# EAGLE design MK2560EM-G v1G.1 (EAGLE 9.5.1)
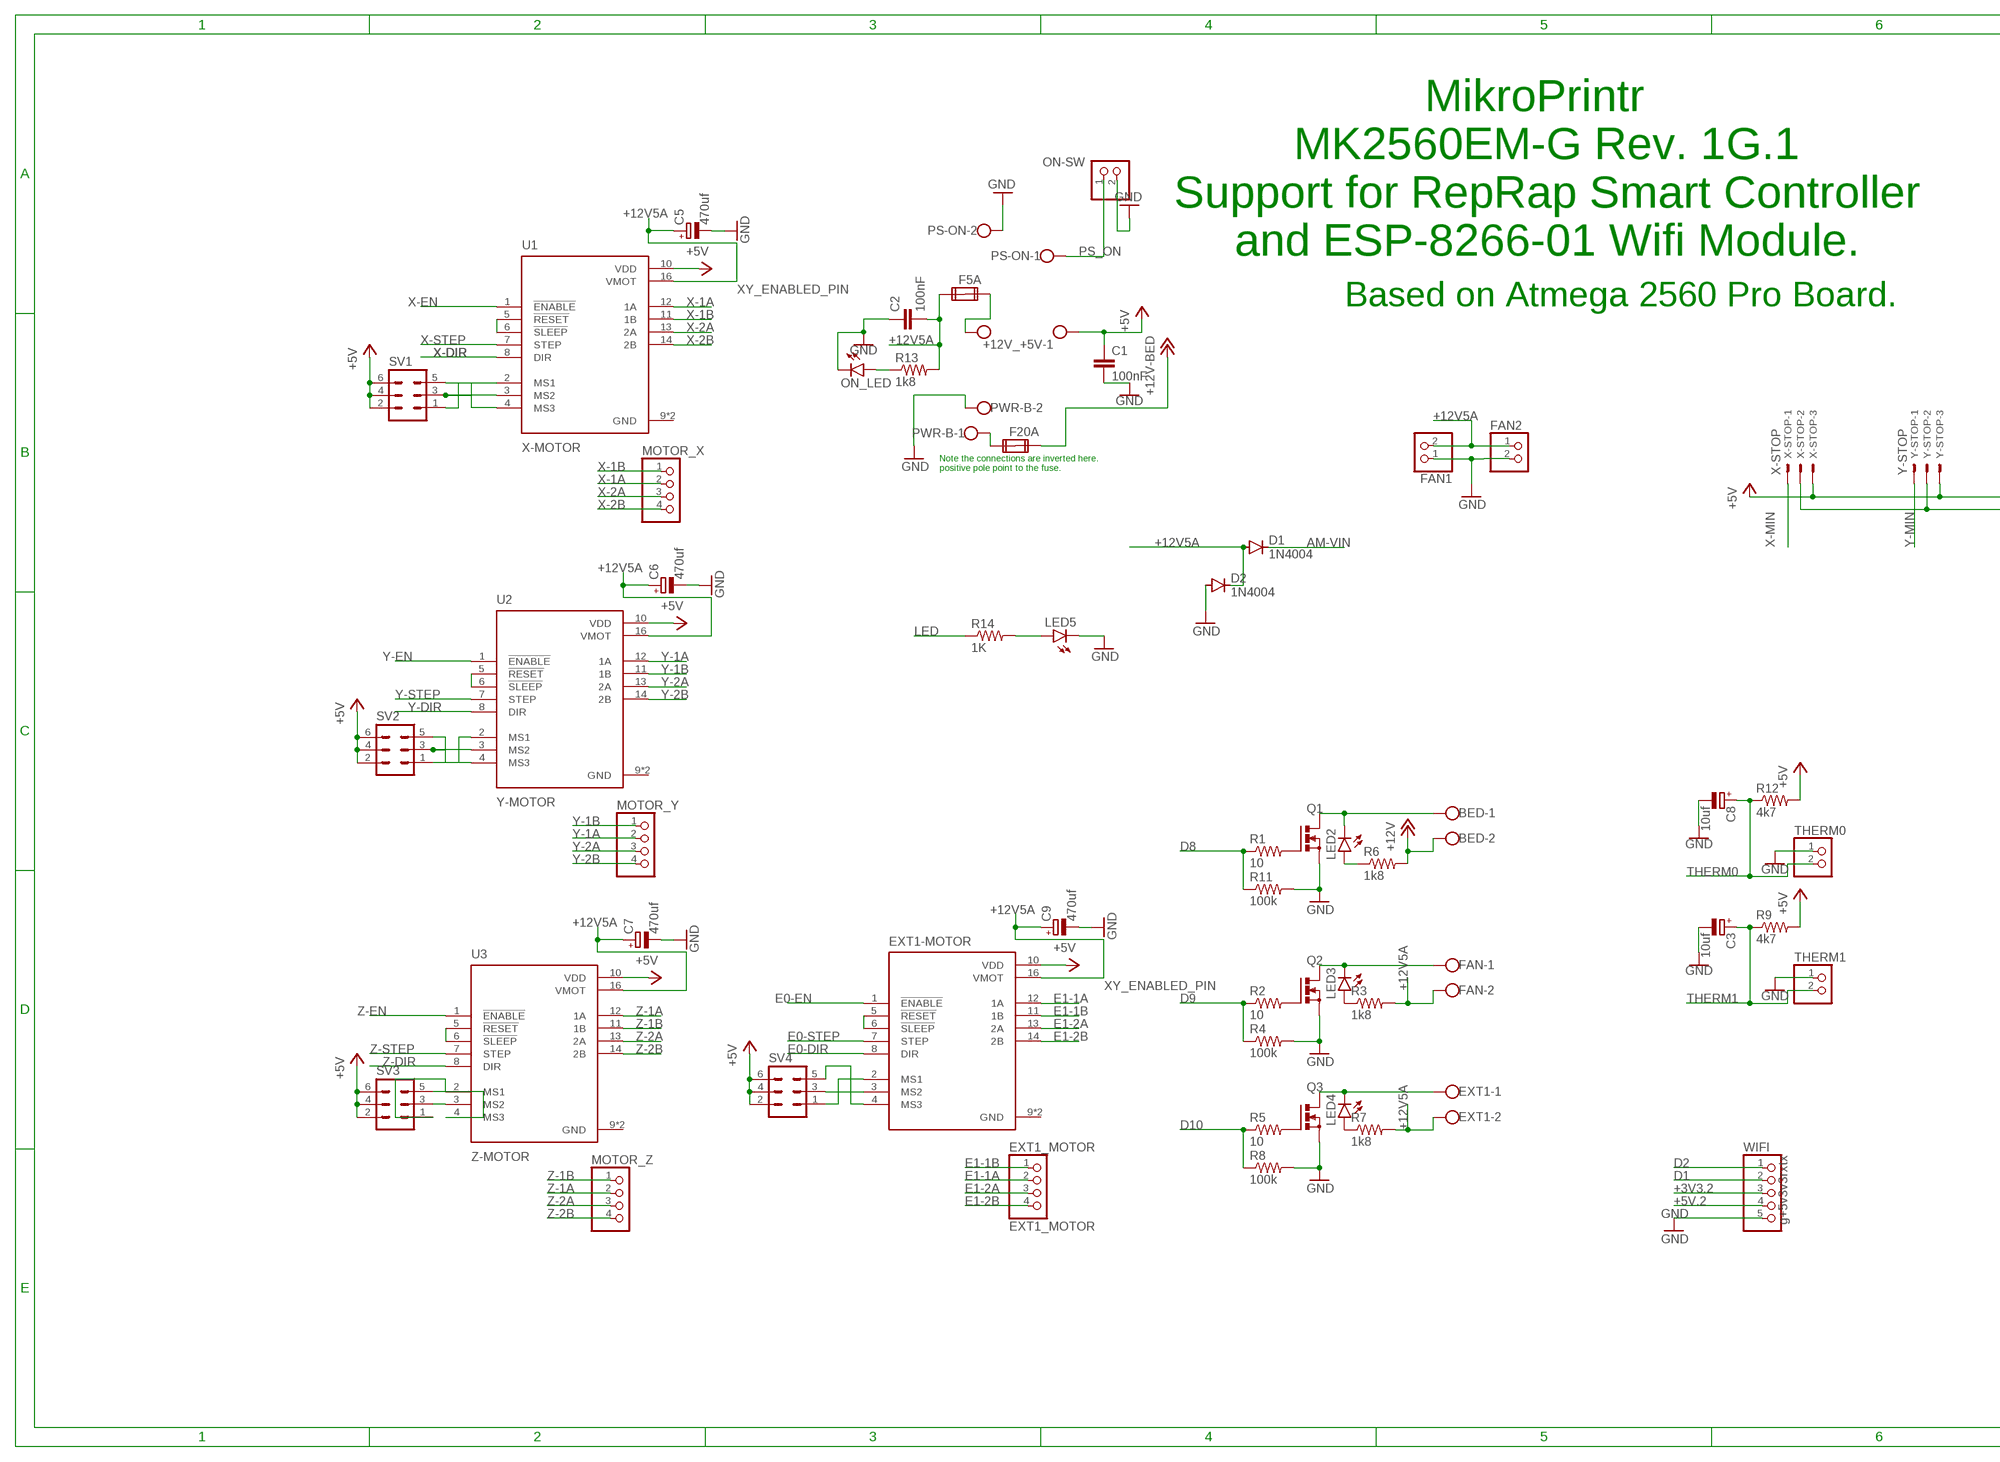
[diagram p0: schematic, sheet 1, part 1 of 2]
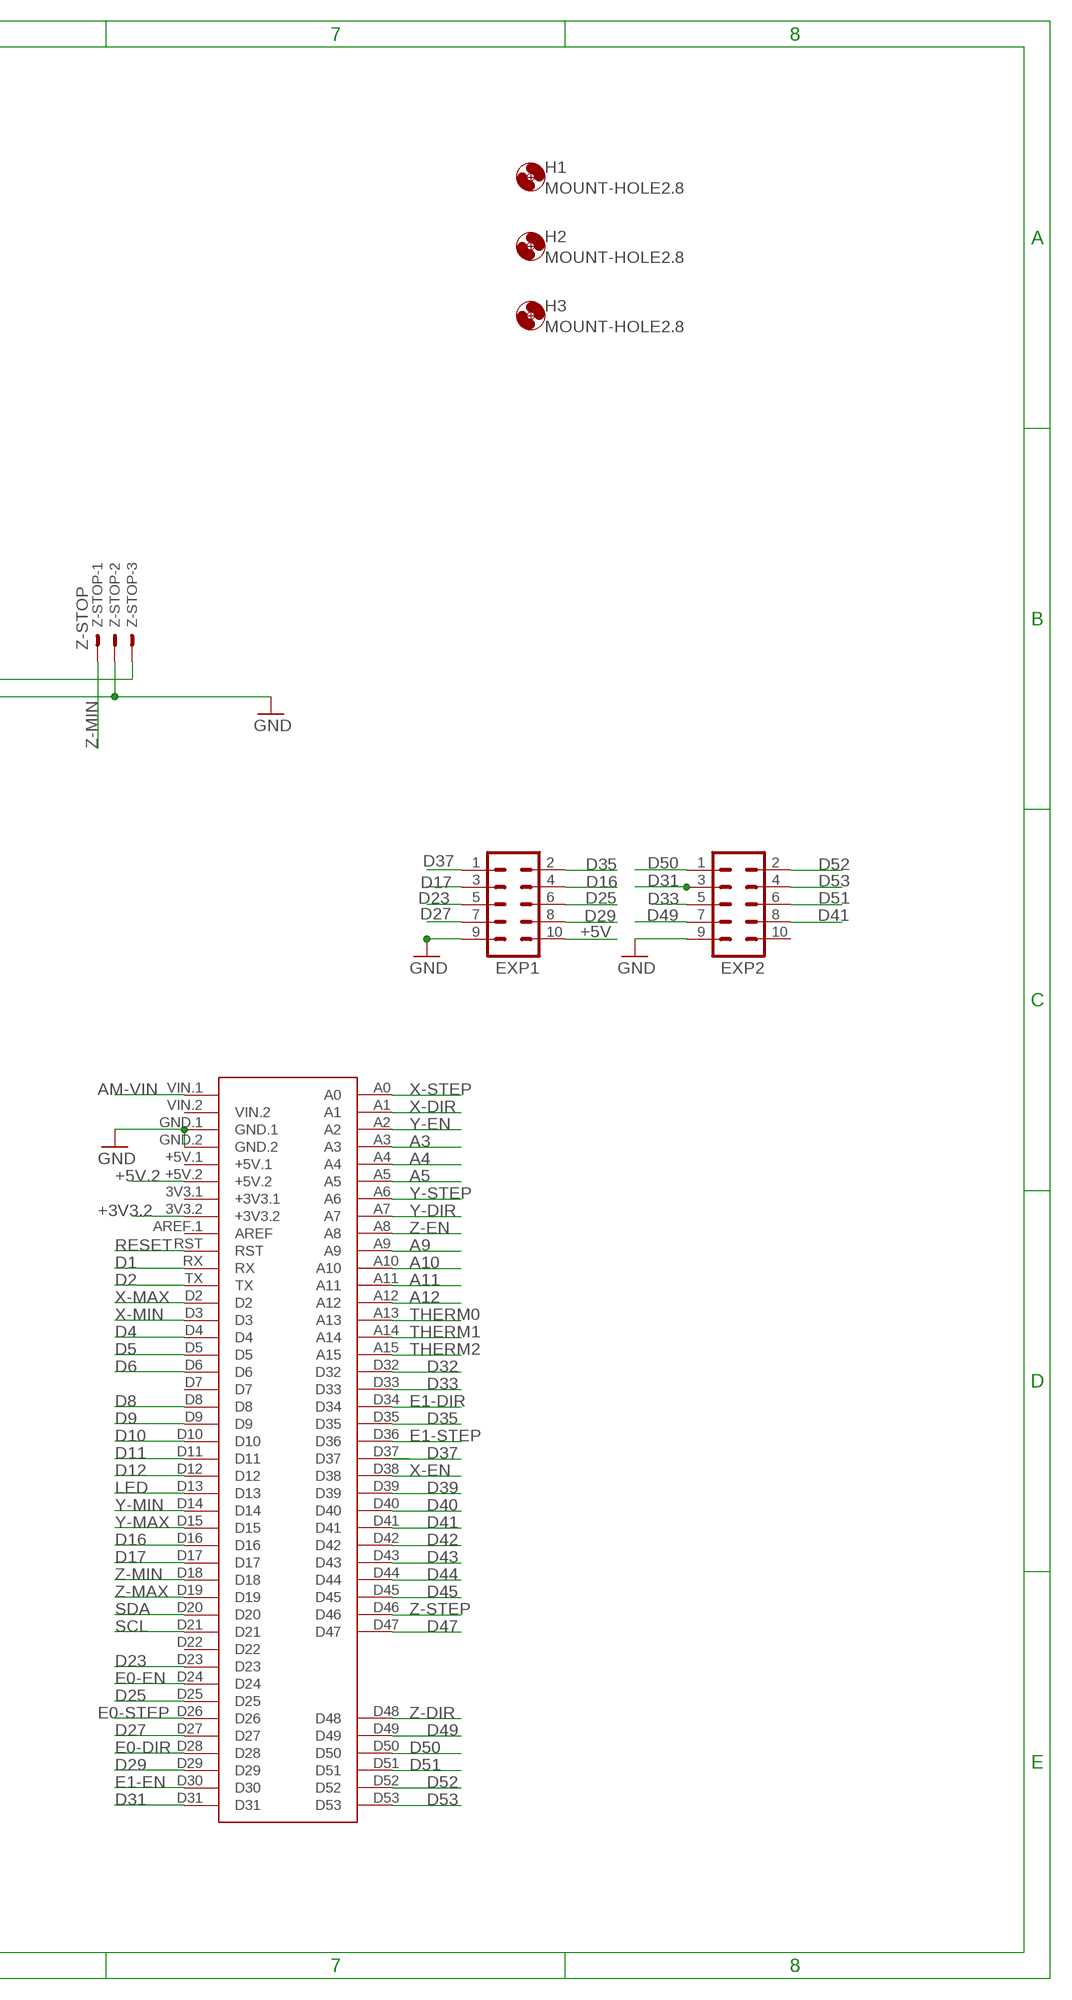
[diagram p1: schematic, sheet 1, part 2 of 2]

## Parts
+12V_+5V  W237-102  [W237-102]
ARD-MEGA  MEGA2560_MIKRO  [MEGA2560_MIKRO]
BED  W237-102  [W237-102]
C1  100nF  C-EU025-025X050  [C025-025X050]
C2  100nF  C-EU025-025X050  [C025-025X050]
C3  10uf  CPOL-EUE2.5-6  [E2,5-6]
C5  470uf  CPOL-EUE2,5-6E  [E2,5-6E]
C6  470uf  CPOL-EUE2,5-6E  [E2,5-6E]
C7  470uf  CPOL-EUE2,5-6E  [E2,5-6E]
C8  10uf  CPOL-EUE2.5-6  [E2,5-6]
C9  470uf  CPOL-EUE2,5-6E  [E2,5-6E]
D1  1N4004  [DO41-10]
D2  1N4004  [DO41-10]
EXP1  MA05-2  [MA05-2]
EXP2  MA05-2  [MA05-2]
EXT1  W237-102  [W237-102]
EXT1-MOTOR  A4988_STEPPER_MOTOR_DRIVER_CARRIER  [MODULE_A4988_STEPPER_MOTOR_DRIVER_CARRIER]
EXT1_MOTOR  EXT1_MOTOR  PINHD-1X4  [1X04]
F5A  FUSE2P  [FUSE1]
F20A  FUSE2P  [FUSE1]
FAN  W237-102  [W237-102]
FAN1  PINHD-1X2  [1X02]
FAN2  PINHD-1X2  [1X02]
H1  MOUNT-HOLE2.8  [2,8]
H2  MOUNT-HOLE2.8  [2,8]
H3  MOUNT-HOLE2.8  [2,8]
LED2  LED3MM  [LED3MM]
LED3  LED3MM  [LED3MM]
LED4  LED3MM  [LED3MM]
LED5  LED3MM  [LED3MM]
MOTOR_X  PINHD-1X4  [1X04]
MOTOR_Y  PINHD-1X4  [1X04]
MOTOR_Z  PINHD-1X4  [1X04]
ON-SW  PINHD-1X2  [1X02]
ON_LED  LED3MM  [LED3MM]
PS-ON  W237-102  [W237-102]
PWR-B  W237-102  [W237-102]
Q1  PMOSFET_NTO220BV  [TO220BV]
Q2  PMOSFET_NTO220BV  [TO220BV]
Q3  PMOSFET_NTO220BV  [TO220BV]
R1  10  R-US_0204/7  [0204/7]
R2  10  R-US_0204/7  [0204/7]
R3  1k8  R-US_0204/7  [0204/7]
R4  100k  R-US_0204/7  [0204/7]
R5  10  R-US_0204/7  [0204/7]
R6  1k8  R-US_0204/7  [0204/7]
R7  1k8  R-US_0204/7  [0204/7]
R8  100k  R-US_0204/7  [0204/7]
R9  4k7  R-US_0204/7  [0204/7]
R11  100k  R-US_0204/7  [0204/7]
R12  4k7  R-US_0204/7  [0204/7]
R13  1k8  R-US_0204/7  [0204/7]
R14  1K  R-US_0204/7  [0204/7]
SV1  MA03-2  [MA03-2]
SV2  MA03-2  [MA03-2]
SV3  MA03-2  [MA03-2]
SV4  MA03-2  [MA03-2]
THERM0  PINHD-1X2  [1X02]
THERM1  PINHD-1X2  [1X02]
U1  X-MOTOR  A4988_STEPPER_MOTOR_DRIVER_CARRIER  [MODULE_A4988_STEPPER_MOTOR_DRIVER_CARRIER]
U2  Y-MOTOR  A4988_STEPPER_MOTOR_DRIVER_CARRIER  [MODULE_A4988_STEPPER_MOTOR_DRIVER_CARRIER]
U3  Z-MOTOR  A4988_STEPPER_MOTOR_DRIVER_CARRIER  [MODULE_A4988_STEPPER_MOTOR_DRIVER_CARRIER]
WIFI  g+5v3v3rxtx  PINHD-1X5  [1X05]
X-STOP  X-STOP  22-23-2031  [22-23-2031]
Y-STOP  Y-STOP  22-23-2031  [22-23-2031]
Z-STOP  Z-STOP  22-23-2031  [22-23-2031]

## Nets
+3V3.2: ARD-MEGA.3V3.2(+3V3.2) WIFI.3
+5V: +12V_+5V.1 C1.1 EXP1.10 EXT1-MOTOR.10(VDD) R9.2 R12.2 SV1.2 SV1.4 SV1.6 SV2.2 SV2.4 SV2.6 SV3.2 SV3.4 SV3.6 SV4.2 SV4.4 SV4.6 U1.10(VDD) U2.10(VDD) U3.10(VDD) X-STOP.3 Y-STOP.3 Z-STOP.3
+5V.2: ARD-MEGA.+5V.2 WIFI.4
+12V: BED.2 F20A.2A R6.2 ; supply symbol labelled +12V-BED
+12V5A: C2.2 C5.+ C6.+ C7.+ C9.+ D1.A D2.C EXT1-MOTOR.16(VMOT) EXT1.2 F5A.1A FAN1.2 FAN2.1 FAN.2 R3.2 R7.2 R13.2 U1.16(VMOT) U2.16(VMOT) U3.16(VMOT)
A3: ARD-MEGA.A3
A4: ARD-MEGA.A4
A5: ARD-MEGA.A5
A9: ARD-MEGA.A9
A10: ARD-MEGA.A10
A11: ARD-MEGA.A11
A12: ARD-MEGA.A12
AM-VIN: ARD-MEGA.VIN.1 D1.C
D1: ARD-MEGA.RX WIFI.2
D2: ARD-MEGA.TX WIFI.1
D4: ARD-MEGA.D4
D5: ARD-MEGA.D5
D6: ARD-MEGA.D6
D8: ARD-MEGA.D8 R1.1 R11.1
D9: ARD-MEGA.D9 R2.1 R4.1
D10: ARD-MEGA.D10 R5.1 R8.1
D11: ARD-MEGA.D11
D12: ARD-MEGA.D12
D16: ARD-MEGA.D16 EXP1.4
D17: ARD-MEGA.D17 EXP1.3
D23: ARD-MEGA.D23 EXP1.5
D25: ARD-MEGA.D25 EXP1.6
D27: ARD-MEGA.D27 EXP1.7
D29: ARD-MEGA.D29 EXP1.8
D31: ARD-MEGA.D31 EXP2.3
D32: ARD-MEGA.D32
D33: ARD-MEGA.D33 EXP2.5
D35: ARD-MEGA.D35 EXP1.2
D37: ARD-MEGA.D37 EXP1.1
D39: ARD-MEGA.D39
D40: ARD-MEGA.D40
D41: ARD-MEGA.D41 EXP2.8
D42: ARD-MEGA.D42
D43: ARD-MEGA.D43
D44: ARD-MEGA.D44
D45: ARD-MEGA.D45
D47: ARD-MEGA.D47
D49: ARD-MEGA.D49 EXP2.7
D50: ARD-MEGA.D50 EXP2.1
D51: ARD-MEGA.D51 EXP2.6
D52: ARD-MEGA.D52 EXP2.2
D53: ARD-MEGA.D53 EXP2.4
E0-DIR: ARD-MEGA.D28 EXT1-MOTOR.8(DIR)
E0-EN: ARD-MEGA.D24 EXT1-MOTOR.1(!ENABLE)
E0-STEP: ARD-MEGA.D26 EXT1-MOTOR.7(STEP)
E1-1A: EXT1-MOTOR.12(1A) EXT1_MOTOR.2
E1-1B: EXT1-MOTOR.11(1B) EXT1_MOTOR.1
E1-2A: EXT1-MOTOR.13(2A) EXT1_MOTOR.3
E1-2B: EXT1-MOTOR.14(2B) EXT1_MOTOR.4
E1-DIR: ARD-MEGA.D34
E1-EN: ARD-MEGA.D30
E1-STEP: ARD-MEGA.D36
GND: ARD-MEGA.GND.1 ARD-MEGA.GND.2 C1.2 C2.1 C3.- C5.- C6.- C7.- C8.- C9.- D2.A EXP1.9 EXP2.9 FAN1.1 FAN2.2 LED5.K(C) ON-SW.2 ON_LED.K(C) PS-ON.2 PWR-B.2 Q1.S Q2.S Q3.S R4.2 R8.2 R11.2 THERM0.1 THERM1.1 WIFI.5 X-STOP.2 Y-STOP.2 Z-STOP.2
LED: ARD-MEGA.D13 R14.1
N$1: Q2.G R2.2
N$2: FAN.1 LED3.K(C) Q2.D
N$3: LED3.A R3.1
N$4: Q3.G R5.2
N$5: EXT1.1 LED4.K(C) Q3.D
N$6: LED4.A R7.1
N$7: BED.1 LED2.K(C) Q1.D
N$8: LED2.A R6.1
N$9: SV1.1 U1.2(MS1)
N$10: SV1.3 U1.3(MS2)
N$11: SV1.5 U1.4(MS3)
N$12: U2.5(!RESET) U2.6(!SLEEP)
N$13: U1.5(!RESET) U1.6(!SLEEP)
N$14: SV2.1 U2.2(MS1)
N$15: SV2.3 U2.3(MS2)
N$16: SV2.5 U2.4(MS3)
N$17: U3.5(!RESET) U3.6(!SLEEP)
N$18: ON_LED.A R13.1
N$19: SV3.3 U3.3(MS2)
N$20: Q1.G R1.2
N$21: SV3.1 U3.2(MS1)
N$22: SV3.5 U3.4(MS3)
N$23: EXT1-MOTOR.5(!RESET) EXT1-MOTOR.6(!SLEEP)
N$24: EXT1-MOTOR.3(MS2) SV4.3
N$25: EXT1-MOTOR.4(MS3) SV4.5
N$26: EXT1-MOTOR.2(MS1) SV4.1
N$27: +12V_+5V.2 F5A.2A
N$28: LED5.A R14.2
N$29: F20A.1A PWR-B.1
PS_ON: ON-SW.1 PS-ON.1
RESET: ARD-MEGA.RST
SCL: ARD-MEGA.D21
SDA: ARD-MEGA.D20
THERM0: ARD-MEGA.A13 C8.+ R12.1 THERM0.2
THERM1: ARD-MEGA.A14 C3.+ R9.1 THERM1.2
THERM2: ARD-MEGA.A15
X-1A: MOTOR_X.2 U1.12(1A)
X-1B: MOTOR_X.1 U1.11(1B)
X-2A: MOTOR_X.3 U1.13(2A)
X-2B: MOTOR_X.4 U1.14(2B)
X-DIR: ARD-MEGA.A1 U1.8(DIR)
X-EN: ARD-MEGA.D38 U1.1(!ENABLE)
X-MAX: ARD-MEGA.D2
X-MIN: ARD-MEGA.D3 X-STOP.1
X-STEP: ARD-MEGA.A0 U1.7(STEP)
Y-1A: MOTOR_Y.2 U2.12(1A)
Y-1B: MOTOR_Y.1 U2.11(1B)
Y-2A: MOTOR_Y.3 U2.13(2A)
Y-2B: MOTOR_Y.4 U2.14(2B)
Y-DIR: ARD-MEGA.A7 U2.8(DIR)
Y-EN: ARD-MEGA.A2 U2.1(!ENABLE)
Y-MAX: ARD-MEGA.D15
Y-MIN: ARD-MEGA.D14 Y-STOP.1
Y-STEP: ARD-MEGA.A6 U2.7(STEP)
Z-1A: MOTOR_Z.2 U3.12(1A)
Z-1B: MOTOR_Z.1 U3.11(1B)
Z-2A: MOTOR_Z.3 U3.13(2A)
Z-2B: MOTOR_Z.4 U3.14(2B)
Z-DIR: ARD-MEGA.D48 U3.8(DIR)
Z-EN: ARD-MEGA.A8 U3.1(!ENABLE)
Z-MAX: ARD-MEGA.D19
Z-MIN: ARD-MEGA.D18 Z-STOP.1
Z-STEP: ARD-MEGA.D46 U3.7(STEP)
Unconnected: ARD-MEGA.3V3.1(+3V3.1) ARD-MEGA.+5V.1 ARD-MEGA.AREF.1(AREF) ARD-MEGA.D7 ARD-MEGA.D22 ARD-MEGA.VIN.2 EXP2.10 F5A.1B F5A.2B F20A.1B F20A.2B

## Notes on the sheet
- MikroPrintr  
  MK2560EM-G Rev. 1G.1
  Support for RepRap Smart Controller
  and ESP-8266-01 Wifi Module.
- Based on Atmega 2560 Pro Board.
- Note the connections are inverted here.
  positive pole point to the fuse.

## Power pins joined to a net without a drawn wire
GND: EXT1-MOTOR.9(GND) EXT1-MOTOR.15(GND) U1.9(GND) U1.15(GND) U2.9(GND) U2.15(GND) U3.9(GND) U3.15(GND)

## Library data of the parts
+12V_+5V BED EXT1 FAN PS-ON PWR-B = con-wago-500:W237-102: WAGO SCREW CLAMP; MPN: 237-102; OC_FARNELL: unknown; OC_NEWARK: 70K9898
ARD-MEGA = MIKRO_MEGA2560:MEGA2560_MIKRO: Arduino Mega2560 pro robotDyn, create by mikroavr.com
C1 C2 = rcl:C-EU: CAPACITOR, European symbol; SPICEPREFIX: C
C3 C5-C9 = rcl:CPOL-EU: POLARIZED CAPACITOR, European symbol; SPICEPREFIX: C
D1 D2 = diode:1N4004: DIODE general purpose rectifier, 1 A
EXP1 EXP2 = con-lstb:MA05-2: PIN HEADER; OC_FARNELL: unknown; OC_NEWARK: unknown
EXT1-MOTOR U1-U3 = A4988_STEPPER_MOTOR_DRIVER_CARRIER:A4988_STEPPER_MOTOR_DRIVER_CARRIER: Stepper motor controler; IC: A4988; 1A; Uin mot: 8÷35V Check availability <https://pricing.snapeda.com/parts/A4988%20STEPPER%20MOTOR%20DRIVER%20CARRIER/Pololu/view-part?ref=eda>; AVAILABILITY: Not in stock; DESCRIPTION: Stepper Motor Driver; MF: Pololu; MP: A4988 STEPPER MOTOR DRIVER CARRIER; PACKAGE: None; PRICE: None
EXT1_MOTOR MOTOR_X MOTOR_Y MOTOR_Z = -redpic-connector:PINHD-1X4: Pin Header 4
F5A F20A = special:FUSE2P: FUSE 5 x 20 mm
FAN1 FAN2 = pinhead:PINHD-1X2: PIN HEADER
H1-H3 = holes:MOUNT-HOLE: MOUNTING HOLE with drill center marker
LED2-LED5 ON_LED = led:LED: LED OSRAM: - CHIPLED LG R971, LG N971, LY N971, LG Q971, LY Q971, LO R971, LY R971 LH N974, LH R974 LS Q976, LO Q976, LY Q976 LO Q996 - Hyper CHIPLED LW Q18S LB Q993, LB Q99A, LB R99A - SideLED LS A670, LO A670, LY A670, LG A670, LP A670 LB A673, LV A673, LT A673, LW A673 LH A674 LY A675 LS A676, LA A676, LO A676, LY A676, LW A676 LS A679, LY A679, LG A679 - Hyper Micro SIDELED® LS Y876, LA Y876, LO Y876, LY Y876 LT Y87S - SmartLED LW L88C, LW L88S LB L89C, LB L89S, LG L890 LS L89K, LO L89K, LY L89K LS L896, LA L896, LO L896, LY L896 - TOPLED LS T670, LO T670, LY T670, LG T670, LP T670 LSG T670, LSP T670, LSY T670, LOP T670, LYG T670 LG T671, LOG T671, LSG T671 LB T673, LV T673, LT T673, LW T673 LH T674 LS T676, LA T676, LO T676, LY T676, LB T676, LH T676, LSB T676, LW T676 LB T67C, LV T67C, LT T67C, LS T67K, LO T67K, LY T67K, LW E67C LS E67B, LA E67B, LO E67B, LY E67B, LB E67C, LV E67C, LT E67C LW T67C LS T679, LY T679, LG T679 LS T770, LO T770, LY T770, LG T770, LP T770 LB T773, LV T773, LT T773, LW T773 LH T774 LS E675, LA E675, LY E675, LS T675 LS T776, LA T776, LO T776, LY T776, LB T776 LHGB T686 LT T68C, LB T68C - Hyper Mini TOPLED® LB M676 - Mini TOPLED Santana® LG M470 LS M47K, LO M47K, LY M47K Source: http://www.osram.convergy.de LUXEON: - LUMILED® LXK2-PW12-R00, LXK2-PW12-S00, LXK2-PW14-U00, LXK2-PW14-V00 LXK2-PM12-R00, LXK2-PM12-S00, LXK2-PM14-U00 LXK2-PE12-Q00, LXK2-PE12-R00, LXK2-PE12-S00, LXK2-PE14-T00, LXK2-PE14-U00 LXK2-PB12-K00, LXK2-PB12-L00, LXK2-PB12-M00, LXK2-PB14-N00, LXK2-PB14-P00, LXK2-PB14-Q00 LXK2-PR12-L00, LXK2-PR12-M00, LXK2-PR14-Q00, LXK2-PR14-R00 LXK2-PD12-Q00, LXK2-PD12-R00, LXK2-PD12-S00 LXK2-PH12-R00, LXK2-PH12-S00 LXK2-PL12-P00, LXK2-PL12-Q00, LXK2-PL12-R00 Source: www.luxeon.com KINGBRIGHT: KA-3528ASYC Source: www.kingbright.com
ON-SW THERM0 THERM1 = -redpic-connector:PINHD-1X2: Pin Header 2
Q1-Q3 = transistor-power:PMOSFET_N: Power MOSFET N-Channel
R1-R9 R11-R14 = resistor:R-US_: RESISTOR, American symbol
SV1-SV4 = con-lstb:MA03-2: PIN HEADER; OC_FARNELL: unknown; OC_NEWARK: unknown
WIFI = pinhead:PINHD-1X5: PIN HEADER
X-STOP Y-STOP Z-STOP = con-molex:22-23-2031: .100" (2.54mm) Center Header - 3 Pin; MF: MOLEX; MPN: 22-23-2031; OC_FARNELL: 1462950; OC_NEWARK: 30C0862

## Board
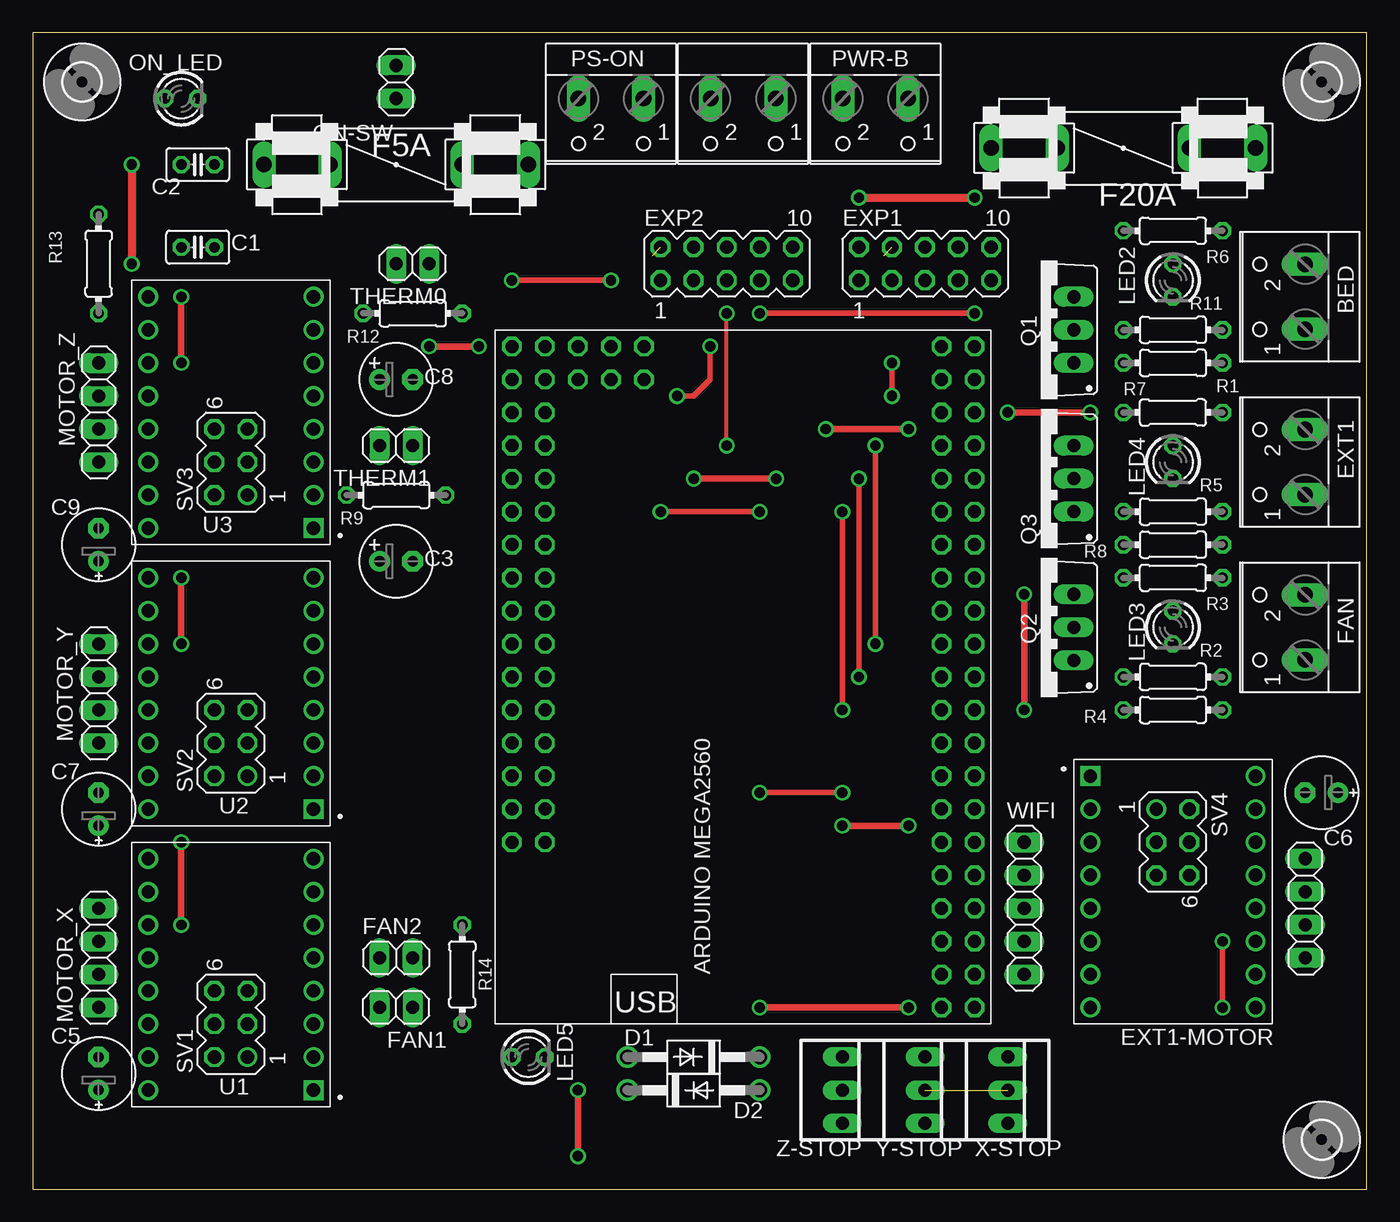
[diagram p2: board, top side]
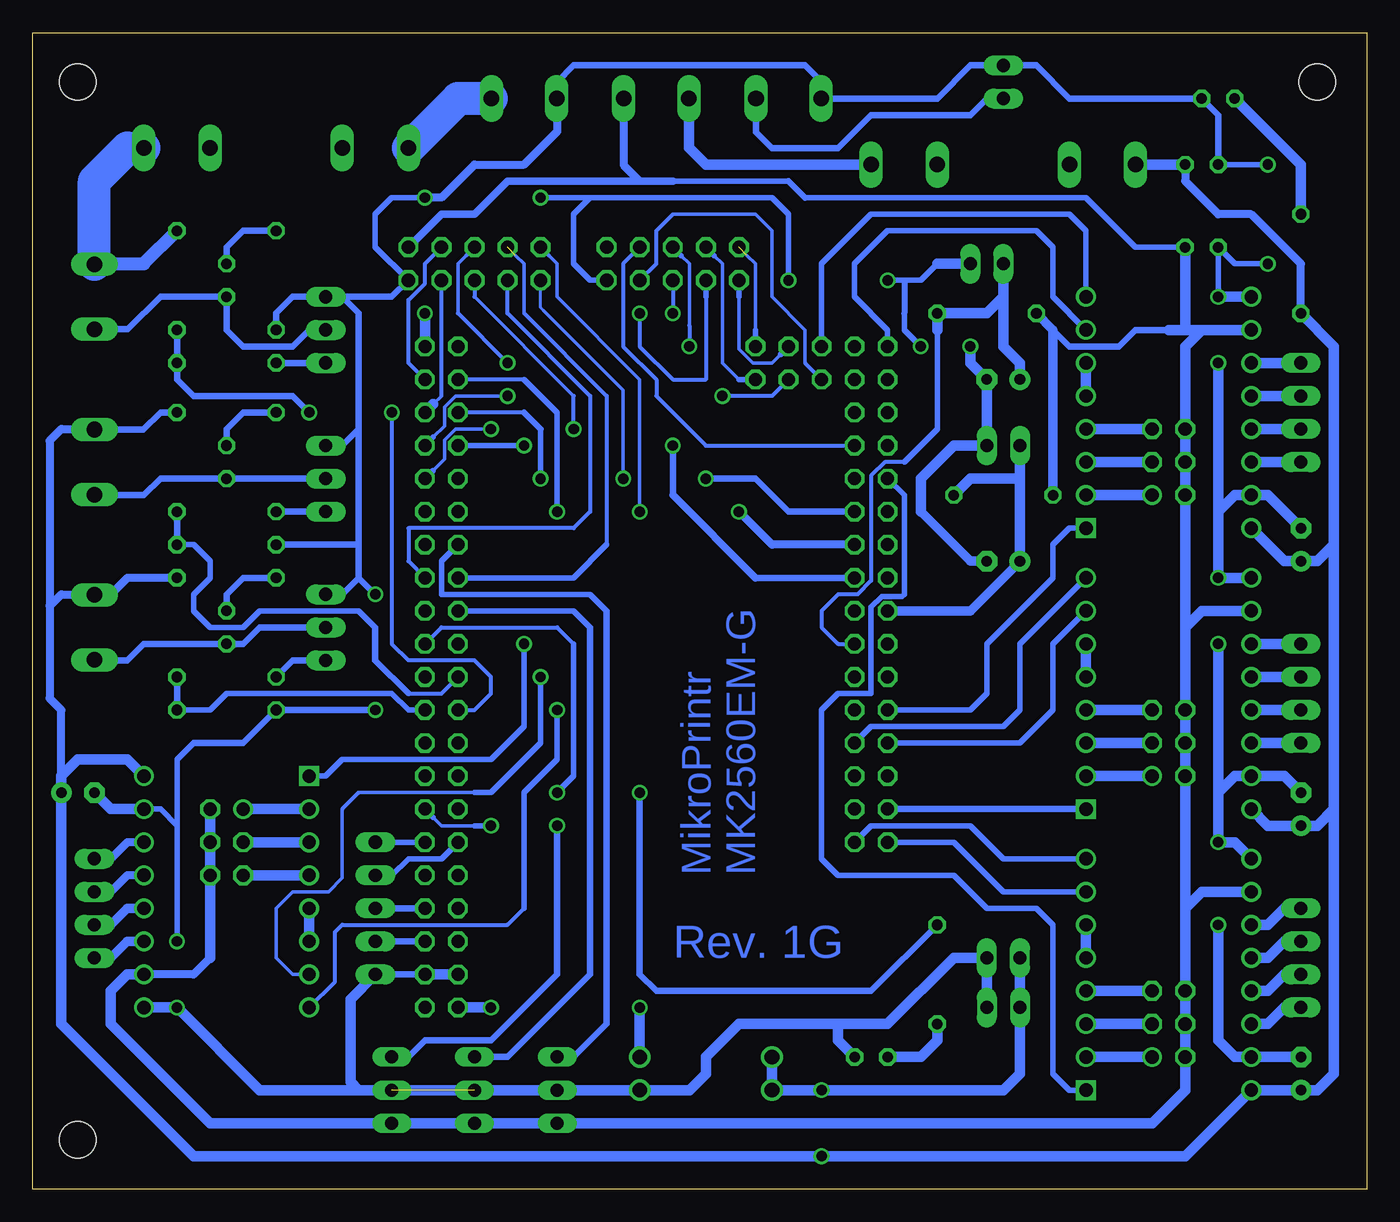
[diagram p3: board, bottom side, seen from below]

Size 102.54 x 88.89 mm. Coordinates in mm from the lower left corner, seen from the top.
Outline: 0,0 102.54,0 102.54,88.89 0,88.89 0,0
Copper layers (1*16): Top 0.035mm / dielectric 1.5mm / Bottom 0.035mm
Design rules "default *": minimum track width 9mil, minimum drill 0.4mm, track to track 6mil, track to pad 6mil, pad to pad 6mil, via to via 6mil, smd to smd 6mil, copper to edge 40mil, drill to drill 6mil, minimum pad ring 10mil, minimum via ring 8mil, stop-mask expansion 4mil, vias tented up to drill 0mil, thermal gap 10mil

### Footprints (pad centres in the part's own frame; a part is rotated, then mirrored left to right if it is on the bottom)
W237-102 = drill 1.194 long: 1 -2.5,-1.27; 2 2.5,-1.27
MEGA2560_MIKRO = drill 1 octagon: 3V3.1 -26.67,-17.78; 3V3.2 -26.67,-20.32; +5V.1 -29.21,-17.78; +5V.2 -29.21,-20.32; A0 -21.59,15.24; A1 -21.59,12.7; A2 -19.05,15.24; A3 -19.05,12.7; A4 -16.51,15.24; A5 -16.51,12.7; A6 -13.97,15.24; A7 -13.97,12.7; A8 -11.43,15.24; A9 -11.43,12.7; A10 -8.89,15.24; A11 -8.89,12.7; A12 -6.35,15.24; A13 -6.35,12.7; A14 -3.81,15.24; A15 -3.81,12.7; AREF.1 -24.13,-17.78; D2 -19.05,-17.78; D3 -19.05,-20.32; D4 -16.51,-17.78; D5 -16.51,-20.32; D6 -13.97,-17.78; D7 -13.97,-20.32; D8 -11.43,-17.78; D9 -11.43,-20.32; D10 -8.89,-17.78; D11 -8.89,-20.32; D12 -6.35,-17.78; D13 -6.35,-20.32; D14 -3.81,-17.78; D15 -3.81,-20.32; D16 -1.27,-17.78; D17 -1.27,-20.32; D18 1.27,-17.78; D19 1.27,-20.32; D20 3.81,-17.78; D21 3.81,-20.32; D22 6.35,-17.78; D23 6.35,-20.32; D24 8.89,-17.78; D25 8.89,-20.32; D26 11.43,-17.78; D27 11.43,-20.32; D28 13.97,-17.78; D29 13.97,-20.32; D30 16.51,-17.78; D31 16.51,-20.32; D32 -1.27,15.24; D33 -1.27,12.7; D34 1.27,15.24; D35 1.27,12.7; D36 3.81,15.24; D37 3.81,12.7; D38 6.35,15.24; D39 6.35,12.7; D40 8.89,15.24; D41 8.89,12.7; D42 11.43,15.24; D43 11.43,12.7; D44 13.97,15.24; D45 13.97,12.7; D46 16.51,15.24; D47 16.51,12.7; D48 16.51,10.16; D49 13.97,10.16; D50 16.51,7.62; D51 13.97,7.62; D52 16.51,5.08; D53 13.97,5.08; GND.1 -31.75,-17.78; GND.2 -31.75,-20.32; RST -24.13,-20.32; RX -21.59,-17.78; TX -21.59,-20.32; VIN.1 -34.29,-17.78; VIN.2 -34.29,-20.32
C025-025X050 = drill 0.813 octagon: 1 -1.27,0; 2 1.27,0
E2,5-6 = drill 0.813 pad 1.6: + -1.27,0 | drill 0.813 pad 1.6 octagon: - 1.27,0
E2,5-6E = drill 0.813 pad 1.575: + -1.27,0 | drill 0.813 pad 1.575 octagon: - 1.27,0
DO41-10 = drill 1.118: A 5.08,0; C -5.08,0
MA05-2 = drill 1.016 octagon: 1 -5.08,-1.27; 2 -5.08,1.27; 3 -2.54,-1.27; 4 -2.54,1.27; 5 0,-1.27; 6 0,1.27; 7 2.54,-1.27; 8 2.54,1.27; 9 5.08,-1.27; 10 5.08,1.27
MODULE_A4988_STEPPER_MOTOR_DRIVER_CARRIER = drill 1.02 square: 1 -6.35,8.89 | drill 1.02: 2 -6.35,6.35; 3 -6.35,3.81; 4 -6.35,1.27; 5 -6.35,-1.27; 6 -6.35,-3.81; 7 -6.35,-6.35; 8 -6.35,-8.89; 9 6.35,-8.89; 10 6.35,-6.35; 11 6.35,-3.81; 12 6.35,-1.27; 13 6.35,1.27; 14 6.35,3.81; 15 6.35,6.35; 16 6.35,8.89
1X04 = drill 1.016 long: 1 -3.81,0; 2 -1.27,0; 3 1.27,0; 4 3.81,0
FUSE1 = drill 1.194 long: 1A -10.16,0; 1B -5.08,0; 2A 10.16,0; 2B 5.08,0
1X02 = drill 1.016 long: 1 -1.27,0; 2 1.27,0
2,8 = hole 2.8: 0,0
LED3MM = drill 0.813 octagon: A -1.27,0; K 1.27,0
TO220BV = drill 1.016 long: D 0,-2.54; G -2.54,-2.54; S 2.54,-2.54
0204/7 = drill 0.813 octagon: 1 -3.81,0; 2 3.81,0
MA03-2 = drill 1.016: 1 -2.54,-1.27 | drill 1.016 octagon: 2 -2.54,1.27; 3 0,-1.27; 4 0,1.27; 5 2.54,-1.27; 6 2.54,1.27
1X05 = drill 1.016 long: 1 -5.08,0; 2 -2.54,0; 3 0,0; 4 2.54,0; 5 5.08,0
22-23-2031 = drill 1 long: 1 -2.54,0; 2 0,0; 3 2.54,0

### Placement (x,y rotation side)
+12V_+5V  54.61,82.55 180 top
ARD-MEGA  52.07,48.26 90 top
BED  96.52,68.58 90 top
C1  12.7,72.39 180 top
C2  12.7,78.74 0 top
C3  27.94,48.26 0 top
C5  5.08,8.89 90 top
C6  99.06,30.48 180 top
C7  5.08,29.21 90 top
C8  27.94,62.23 0 top
C9  5.08,49.53 90 top
D1  50.8,10.16 180 top
D2  50.8,7.62 0 top
EXP1  68.58,71.12 0 top
EXP2  53.34,71.12 0 top
EXT1  96.52,55.88 90 top
EXT1-MOTOR  87.63,22.86 0 top
EXT1_MOTOR  97.79,21.59 90 top
F5A  27.94,78.74 0 top
F20A  83.82,80.01 0 top
FAN  96.52,43.18 90 top
FAN1  27.94,13.97 180 top
FAN2  27.94,17.78 0 top
H1  3.81,85.09 0 top
H2  99.06,85.09 0 top
H3  99.06,3.81 0 top
LED2  87.63,69.85 270 top
LED3  87.63,43.18 270 top
LED4  87.63,55.88 270 top
LED5  38.1,10.16 0 top
MOTOR_X  5.08,17.78 270 top
MOTOR_Y  5.08,38.1 270 top
MOTOR_Z  5.08,59.69 270 top
ON-SW  27.94,85.09 90 top
ON_LED  11.43,83.82 0 top
PS-ON  44.45,82.55 180 top
PWR-B  64.77,82.55 180 top
Q1  77.47,66.04 90 top
Q2  77.47,43.18 90 top
Q3  77.47,54.61 90 top
R1  87.63,63.5 180 top
R2  87.63,39.37 180 top
R3  87.63,46.99 0 top
R4  87.63,36.83 180 top
R5  87.63,52.07 180 top
R6  87.63,73.66 0 top
R7  87.63,59.69 0 top
R8  87.63,49.53 180 top
R9  27.94,53.34 180 top
R11  87.63,66.04 180 top
R12  29.21,67.31 180 top
R13  5.08,71.12 270 top
R14  33.02,16.51 270 top
SV1  15.24,12.7 90 top
SV2  15.24,34.29 90 top
SV3  15.24,55.88 90 top
SV4  87.63,26.67 270 top
THERM0  29.21,71.12 180 top
THERM1  27.94,57.15 180 top
U1  15.24,16.51 180 top
U2  15.24,38.1 180 top
U3  15.24,59.69 180 top
WIFI  76.2,21.59 270 top
X-STOP  74.93,7.62 270 top
Y-STOP  68.58,7.62 270 top
Z-STOP  62.23,7.62 270 top

### Tracks (layer width: path | path; a pad name or v marks a point on that pad's centre or on a via)
+3V3.2
  Bottom 0.508: WIFI.3 ARD-MEGA.3V3.2
+5V
  Bottom 0.406: C1.1 17.78,72.39 21.59,76.2 43.18,76.2 | 53.34,77.47 44.45,77.47
  Bottom 0.508: 44.45,77.47 43.18,76.2 | R12.2 22.86,64.77 19.05,64.77 17.78,66.04 15.24,66.04
  Bottom 0.559: 53.34,77.47 55.88,77.47 66.04,77.47 68.58,74.93 71.12,74.93 EXP1.10
  Bottom 0.61: 88.9,17.78 90.17,16.51 EXT1-MOTOR.10 | +12V_+5V.1 57.11,78.7 55.88,77.47
  Bottom 0.711: R9.2 24.13,66.04 R12.2
  Bottom 0.813: U3.10 12.7,66.04 | 12.7,66.04 13.97,64.77 SV3.6 SV3.4 SV3.2 13.97,43.18 | U2.10 12.7,44.45 13.97,43.18 | 12.7,66.04 13.97,66.04 | 13.97,66.04 15.24,66.04 | 13.97,66.04 C1.1 | U1.10 12.7,22.86 13.97,21.59 | EXT1-MOTOR.10 95.25,16.51 96.52,15.24 96.52,12.7 88.9,5.08 X-STOP.3 Y-STOP.3 Z-STOP.3 16.51,5.08 13.97,7.62 SV1.2 SV1.4 SV1.6 13.97,21.59 | 13.97,43.18 SV2.6 SV2.4 SV2.2 13.97,21.59 | 88.9,17.78 SV4.6 SV4.4 SV4.2
+5V.2
  Bottom 0.508: WIFI.4 ARD-MEGA.+5V.2
+12V
  Bottom 1.016: R6.2 93.98,71.12 97.75,71.12 BED.2
  Bottom 2.54: 97.79,71.16 97.75,71.12 | BED.2 97.79,77.47 95.25,80.01 F20A.2A
+12V5A  (via drill 0.8)
  Top 0.508: v41.91,7.62 v41.91,2.54
  Bottom 0.406: 2.54,27.94 2.54,29.21 2.54,49.53
  Bottom 0.508: FAN2.1 FAN1.2 26.67,12.7 26.67,8.89 | R7.2 92.71,59.69 94.02,58.38 EXT1.2 97.83,58.38
  Bottom 0.61: 100.33,31.75 100.33,36.83 101.22,37.72 101.22,44.83 | EXT1.2 100.29,58.38 100.33,58.42 101.22,57.53 101.22,44.83 | 101.22,44.83 100.33,45.72 97.83,45.72 | 97.83,45.72 FAN.2 | R3.2 95.25,46.99 96.52,45.72 97.83,45.72 | C2.2 13.97,77.47 11.43,74.93 8.89,74.93 5.08,71.12 R13.2
  Bottom 0.813: 2.54,49.53 2.54,27.94 2.54,8.89 3.81,7.62 C5.+ U1.16 13.97,2.54 v41.91,2.54 90.17,2.54 100.33,12.7 C6.+ 100.33,31.75 99.06,33.02 95.25,33.02 EXT1-MOTOR.16 | 2.54,29.21 3.81,27.94 C7.+ 7.62,27.94 U2.16 | 2.54,49.53 3.81,48.26 C9.+ 6.35,48.26 U3.16 | D1.A D2.C v41.91,7.62 27.94,7.62 26.67,8.89 FAN1.2 | FAN2.1 26.67,12.7 | 2.54,49.53 2.54,64.77 R13.2 | C2.2 F5A.1A
AM-VIN  (via drill 0.8)
  Top 0.508: v55.88,13.97 v67.31,13.97
  Bottom 0.813: v67.31,13.97 ARD-MEGA.VIN.1 | D1.C v55.88,13.97
D1
  Bottom 0.406: ARD-MEGA.RX 71.12,25.4 73.66,25.4 74.93,24.13 WIFI.2
D2
  Bottom 0.406: WIFI.1 ARD-MEGA.TX
D8  (via drill 0.8)
  Top 0.508: v81.28,59.69 v74.93,59.69
  Bottom 0.305: ARD-MEGA.D8 68.58,36.83 67.31,38.1 67.31,39.37 68.58,40.64 73.66,40.64 74.93,41.91 v74.93,59.69
  Bottom 0.508: R11.1 R1.1 91.44,62.23 90.17,60.96 82.55,60.96 v81.28,59.69
D9
  Bottom 0.406: ARD-MEGA.D9 73.66,36.83 74.93,38.1 87.63,38.1 88.9,36.83 R4.1
  Bottom 0.508: R2.1 R4.1
D10
  Bottom 0.305: ARD-MEGA.D10 71.12,38.1 73.66,38.1
  Bottom 0.406: 76.2,40.64 73.66,38.1 | 76.2,43.18 77.47,44.45 85.09,44.45 86.36,43.18 88.9,43.18 90.17,44.45 90.17,45.72 88.9,46.99 88.9,48.26 90.17,49.53 R8.1
  Bottom 0.508: R5.1 R8.1 | 76.2,40.64 76.2,43.18
D16  (1 unrouted)
  Bottom 0.254: 64.77,67.31 64.77,71.12 65.41,71.75
  Bottom 0.305: 64.77,67.31 58.42,60.96 58.42,49.53
  Bottom 0.406: ARD-MEGA.D16 60.96,46.99 58.42,49.53
D17
  Bottom 0.305: ARD-MEGA.D17 73.66,48.26 73.66,50.8 60.96,50.8 59.69,52.07 59.69,60.96 66.04,67.31 EXP1.3
D23  (via drill 0.8)
  Top 0.508: v67.31,58.42 v60.96,58.42
  Bottom 0.254: 71.76,55.24 70.88,56.12 70.88,57.58 70.04,58.42 v67.31,58.42 | 68.58,68.58 60.96,60.96
  Bottom 0.305: v60.96,58.42 60.96,60.96 | EXP1.5 68.58,68.58
  Bottom 0.406: ARD-MEGA.D23 71.76,55.24
D25  (via drill 0.8)
  Top 0.406: v66.04,63.5 v66.04,60.96
  Bottom 0.254: 71.76,57.79 70.88,58.66 70.88,60.12 70.04,60.96 v66.04,60.96 | 69.85,67.31 69.85,71.12 69.22,71.75
  Bottom 0.305: 69.85,67.31 v66.04,63.5 | EXP1.6 69.22,71.75
  Bottom 0.406: ARD-MEGA.D25 71.76,57.79
D27
  Bottom 0.254: 71.76,60.33 71.12,60.96
  Bottom 0.305: 71.12,60.96 EXP1.7
  Bottom 0.813: ARD-MEGA.D27 71.76,60.33
D29
  Bottom 0.305: ARD-MEGA.D29 73.66,63.5 73.66,68.34 72.39,69.61 72.39,71.12 EXP1.8
D31  (via drill 0.8)
  Top 0.406: v72.39,67.31 v55.88,67.31
  Bottom 0.305: v55.88,67.31 55.88,64.77 53.34,62.23 50.8,62.23 50.8,68.58
  Bottom 0.406: EXP2.3 50.8,68.58
  Bottom 0.813: v72.39,67.31 ARD-MEGA.D31
D33  (via drill 0.8)
  Top 0.305: v53.34,57.15 v53.34,67.31
  Bottom 0.305: EXP2.5 v53.34,67.31
  Bottom 0.508: v53.34,57.15 53.34,53.34 | 46.99,46.99 ARD-MEGA.D33
  Bottom 0.559: 53.34,53.34 46.99,46.99
D35  (via drill 0.8)
  Top 0.406: v55.88,52.07 v48.26,52.07
  Bottom 0.254: v55.88,52.07 55.88,62.23 62.23,68.58 62.23,71.12 62.87,71.75
  Bottom 0.305: 62.87,71.75 EXP1.2
  Bottom 0.61: ARD-MEGA.D35 45.72,49.53 v48.26,52.07
D37  (via drill 0.8)
  Top 0.508: v57.15,54.61 v50.8,54.61
  Bottom 0.229: 63.27,67.54 63.5,67.76 EXP1.1
  Bottom 0.254: v57.15,54.61 57.15,61.41 63.27,67.54
  Bottom 0.508: v50.8,54.61 46.99,54.61 44.45,52.07 ARD-MEGA.D37
D41
  Bottom 0.305: EXP2.8 57.15,71.12 57.15,64.77 54.61,62.23 54.61,60.96 50.8,57.15 ARD-MEGA.D41
D49
  Bottom 0.254: 42.55,62.87 43.18,63.5 43.18,66.04 45.72,68.58 45.72,73.66 46.99,74.93 53.34,74.93
  Bottom 0.305: EXP2.7 54.61,71.12 54.61,73.66 53.34,74.93 | 43.18,63.5 ARD-MEGA.D49
D50
  Bottom 0.254: 45.09,64.13 45.72,63.5 47.18,63.5 48.26,64.58 48.26,68.58
  Bottom 0.406: EXP2.1 48.26,68.58 | ARD-MEGA.D50 45.09,64.13
D51  (via drill 0.8)
  Top 0.406: v52.07,64.77 52.07,62.23 50.8,60.96 v49.53,60.96
  Bottom 0.254: 52.7,71.75 52.07,71.12 52.07,66.38
  Bottom 0.305: ARD-MEGA.D51 45.72,60.96 v49.53,60.96 | 52.07,66.38 v52.07,64.77
  Bottom 0.406: EXP2.6 52.7,71.75
D52  (1 unrouted)
  Bottom 0.254: 46.99,66.04 46.99,71.12 47.62,71.75
  Bottom 0.406: 46.99,66.04 ARD-MEGA.D52
D53
  Bottom 0.254: 48.26,62.23 49.53,63.5 49.53,71.12 50.16,71.75
  Bottom 0.406: EXP2.4 50.16,71.75 | 48.26,62.23 ARD-MEGA.D53
E0-DIR  (via drill 0.8)
  Top 0.406: v62.23,52.07 v62.23,36.83
  Bottom 0.305: 64.77,62.23 ARD-MEGA.D28 | 64.77,21.59 66.04,20.32 78.74,20.32 79.3,19.76 79.3,15.95 EXT1-MOTOR.8
  Bottom 0.406: v62.23,36.83 62.23,33.02 64.77,30.48 64.77,21.59 | v62.23,52.07 62.23,59.69 64.77,62.23
E0-EN  (via drill 0.8)
  Top 0.406: v64.77,41.91 v64.77,57.15
  Bottom 0.406: EXT1-MOTOR.1 80.01,31.75 78.74,33.02 67.31,33.02 64.77,35.56 v64.77,41.91 | v64.77,57.15 ARD-MEGA.D24
E0-STEP  (via drill 0.8)
  Top 0.406: v63.5,39.37 v63.5,54.61
  Bottom 0.254: 77.47,30.48 68.58,30.48 | 78.74,29.21 78.74,23.92 79.8,22.86 82.55,22.86 83.82,21.59 83.82,17.78 82.55,16.51 EXT1-MOTOR.7
  Bottom 0.305: 64.77,59.69 ARD-MEGA.D26 | 77.47,30.48 78.74,29.21
  Bottom 0.406: 63.5,58.42 v63.5,54.61 | v63.5,39.37 63.5,34.29 67.31,30.48 68.58,30.48
  Bottom 0.508: 64.77,59.69 63.5,58.42
E1-1A
  Bottom 0.711: EXT1-MOTOR.12 95.25,21.59 96.52,20.32 EXT1_MOTOR.2
E1-1B
  Bottom 0.711: EXT1-MOTOR.11 95.25,19.05 96.52,17.78 EXT1_MOTOR.1
E1-2A
  Bottom 0.61: EXT1-MOTOR.13 95.25,24.13 96.52,22.86 EXT1_MOTOR.3
E1-2B
  Bottom 0.61: EXT1-MOTOR.14 95.25,26.67 96.52,25.4 EXT1_MOTOR.4
GND  (via drill 0.8)  (1 unrouted)
  Top 0.406: v91.44,19.05 v91.44,13.97 | v36.83,69.85 v44.45,69.85
  Top 0.508: v11.43,68.58 v11.43,63.5 | v34.29,64.77 v30.48,64.77 | v11.43,41.91 v11.43,46.99 | v11.43,26.67 v11.43,20.32 | v76.2,45.72 v76.2,36.83
  Top 0.61: v7.62,78.74 v7.62,71.12 | v63.5,76.2 v72.39,76.2
  Bottom 0.406: v11.43,26.67 11.43,30.48 v11.43,41.91 | C3.- 29.21,48.01 | v11.43,46.99 11.43,52.07 v11.43,63.5 | 33.02,71.12 34.29,69.85 35.56,69.85 v36.83,69.85 | 35.56,67.31 35.56,66.04 v34.29,64.77 | v63.5,76.2 59.69,76.2 | 59.69,76.2 45.72,76.2 44.45,74.93 v44.45,69.85 | 59.69,76.2 60.96,74.93 60.96,71.12 59.69,69.85 EXP2.9 | 90.17,34.29 91.44,33.02 91.44,27.94 | 91.44,27.94 v91.44,19.05 | EXT1-MOTOR.15 92.71,29.21 91.44,27.94 | v7.62,71.12 10.16,71.12 C1.2 v11.43,68.58 | C2.1 v7.62,78.74 | v72.39,76.2 74.93,76.2 76.2,74.93 76.2,72.39 EXP1.9
  Bottom 0.457: 35.56,69.85 35.56,67.31
  Bottom 0.508: ARD-MEGA.GND.2 WIFI.5 | EXP1.9 74.93,68.58 78.74,68.58 | 78.74,68.58 Q1.S 82.55,68.58 83.82,67.31 R11.2 | 78.74,68.58 77.47,67.31 77.47,58.42 | 77.47,58.42 78.74,57.15 Q3.S | 77.47,58.42 77.47,49.53 | 77.47,49.53 77.47,46.99 | 77.47,46.99 78.74,45.72 Q2.S | 90.17,34.29 86.36,34.29 R4.2 v76.2,36.83 | 77.47,49.53 R8.2 | C2.1 11.43,82.55 ON_LED.K 22.86,83.82 25.4,86.36 ON-SW.2 30.48,86.36 33.02,83.82 PS-ON.2 41.95,85.13 43.18,86.36 60.96,86.36 62.23,85.09 62.23,83.78 | 77.47,46.99 v76.2,45.72
  Bottom 0.61: v72.39,76.2 71.12,76.2 68.58,78.74 64.77,78.74 62.23,81.28 62.23,83.78 | 62.23,83.78 PWR-B.2 | 62.23,83.82 62.23,83.78
  Bottom 0.711: C3.- 30.48,48.26 34.29,52.07
  Bottom 0.813: ARD-MEGA.GND.1 ARD-MEGA.GND.2 | U3.9 v11.43,68.58 | C5.- U1.15 10.16,10.16 11.43,11.43 v11.43,20.32 | C7.- 6.35,31.75 U2.15 10.16,31.75 11.43,30.48 | U2.9 v11.43,46.99 v11.43,63.5 | U1.9 10.16,26.67 v11.43,26.67 v11.43,41.91 | C9.- 7.62,53.34 U3.15 10.16,53.34 11.43,52.07 | LED5.K 40.64,11.43 40.64,12.7 | FAN1.1 FAN2.2 31.75,17.78 36.83,12.7 40.64,12.7 | 40.64,12.7 48.26,12.7 50.8,10.16 50.8,8.89 52.07,7.62 D2.A Z-STOP.2 Y-STOP.2 77.47,7.62 | 34.29,52.07 34.29,54.61 31.75,57.15 THERM1.1 C8.- 30.48,63.5 v30.48,64.77 | 77.47,7.62 85.09,7.62 v91.44,13.97 EXT1-MOTOR.9 | EXT1-MOTOR.15 96.52,29.21 C6.- | THERM0.1 33.02,71.12 | 77.47,7.62 78.11,8.26 78.11,14.61 WIFI.5
LED  (via drill 0.8)
  Top 0.406: v55.88,30.48 v62.23,30.48
  Bottom 0.305: ARD-MEGA.D13 71.12,43.18 62.23,43.18 60.96,41.91
  Bottom 0.406: 60.96,41.91 60.96,31.75 v62.23,30.48
  Bottom 0.508: v55.88,30.48 55.88,16.51 54.61,15.24 38.1,15.24 R14.1
N$1
  Bottom 0.508: Q2.G 82.55,40.64 R2.2
N$2
  Bottom 0.508: Q2.D 85.09,43.18 86.36,41.91 LED3.K 93.98,41.91 95.25,40.64 97.75,40.64 FAN.1
N$3
  Bottom 0.508: R3.1 86.36,46.99 87.63,45.72 LED3.A
N$4
  Bottom 0.508: R5.2 Q3.G
N$5
  Bottom 0.508: EXT1.1 97.75,53.34 93.98,53.34 92.71,54.61 LED4.K Q3.D
N$6
  Bottom 0.508: R7.1 86.36,59.69 87.63,58.42 LED4.A
N$7
  Bottom 0.508: BED.1 95.21,66.08 92.71,68.58 LED2.K 87.63,66.04 86.36,64.77 82.55,64.77 81.28,66.04 Q1.D
N$8
  Bottom 0.508: R6.1 86.36,73.66 87.63,72.39 LED2.A
N$9
  Bottom 0.813: SV1.1 U1.2
N$10
  Bottom 0.813: SV1.3 U1.3
N$11
  Bottom 0.813: SV1.5 U1.4
N$12
  Bottom 0.813: U2.6 U2.5
N$13
  Bottom 0.813: U1.6 U1.5
N$14
  Bottom 0.813: SV2.1 U2.2
N$15
  Bottom 0.813: SV2.3 U2.3
N$16
  Bottom 0.813: SV2.5 U2.4
N$17
  Bottom 0.813: U3.6 U3.5
N$18
  Bottom 0.813: ON_LED.A 5.08,78.74 R13.1
N$19
  Bottom 0.813: SV3.3 U3.3
N$20
  Bottom 0.508: Q1.G R1.2
N$21
  Bottom 0.813: SV3.1 U3.2
N$22
  Bottom 0.813: SV3.5 U3.4
N$23
  Bottom 0.813: EXT1-MOTOR.5 EXT1-MOTOR.6
N$24
  Bottom 0.813: EXT1-MOTOR.3 SV4.3
N$25
  Bottom 0.813: EXT1-MOTOR.4 SV4.5
N$26
  Bottom 0.813: EXT1-MOTOR.2 SV4.1
N$27
  Bottom 0.813: +12V_+5V.2 52.11,80.05 50.8,78.74 F5A.2A
N$28
  Bottom 0.813: LED5.A 34.29,10.16 33.02,11.43 R14.2
N$29
  Bottom 2.54: PWR-B.1 69.85,83.82 F20A.1A
PS_ON
  Bottom 0.508: PS-ON.1 46.95,81.24 45.72,80.01 40.64,80.01 38.1,82.55 30.48,82.55 29.21,83.82 ON-SW.1
THERM0
  Bottom 0.305: ARD-MEGA.A13 40.64,41.91 41.91,43.18 41.91,44.45 40.64,45.72 39.14,45.72 38.1,46.76 38.1,54.84 37.06,55.88 35.56,55.88
  Bottom 0.406: 33.02,66.04 33.02,58.42 35.56,55.88
  Bottom 0.813: 33.02,66.04 R12.1 29.21,67.31 27.94,68.58 | 28.19,70.87 THERM0.2 27.94,68.58 | 27.94,68.58 27.94,64.77 26.67,63.5 C8.+
THERM1
  Bottom 0.61: 26.8,48.13 C3.+
  Bottom 0.711: 26.8,48.13 30.48,44.45 ARD-MEGA.A14
  Bottom 0.813: C3.+ 26.67,54.61 | 26.67,54.61 THERM1.2 | R9.1 30.48,54.61 26.67,54.61
X-1A
  Bottom 0.813: MOTOR_X.2 6.35,19.05 7.62,17.78 U1.12
X-1B
  Bottom 0.813: MOTOR_X.1 6.35,21.59 7.62,20.32 U1.11
X-2A
  Bottom 0.813: MOTOR_X.3 6.35,16.51 7.62,15.24 U1.13
X-2B
  Bottom 0.813: MOTOR_X.4 6.35,13.97 7.62,12.7 U1.14
X-DIR
  Bottom 0.406: ARD-MEGA.A1 38.1,27.94 30.48,27.94 27.94,25.4 U1.8
X-EN
  Bottom 0.406: U1.1 22.86,7.62 24.13,8.89 24.13,20.32 25.4,21.59 29.21,21.59 31.75,24.13 40.64,24.13 41.91,25.4 41.91,36.83 40.64,38.1 38.1,38.1 38.1,44.75 37.29,45.56 35.72,45.56 35.56,45.72 35.56,53.34 ARD-MEGA.D38
X-MIN  (via drill 0.8)
  Top 0.508: v62.23,27.94 v67.31,27.94
  Bottom 0.254: 68.58,27.94 71.12,27.94 71.76,28.57
  Bottom 0.406: v67.31,27.94 68.58,27.94 | ARD-MEGA.D3 71.76,28.57
  Bottom 0.508: v62.23,27.94 62.23,16.51 67.31,11.43 72.39,11.43 73.66,10.16 X-STOP.1
X-STEP
  Bottom 0.406: ARD-MEGA.A0 31.75,26.67 27.94,22.86 U1.7
Y-1A
  Bottom 0.813: MOTOR_Y.2 U2.12
Y-1B
  Bottom 0.813: MOTOR_Y.1 U2.11
Y-2A
  Bottom 0.813: MOTOR_Y.3 U2.13
Y-2B
  Bottom 0.813: MOTOR_Y.4 U2.14
Y-DIR
  Bottom 0.406: U2.8 26.67,41.91 26.67,36.83 27.94,35.56 38.1,35.56 ARD-MEGA.A7
Y-EN
  Bottom 0.508: ARD-MEGA.A2 U2.1
Y-MIN
  Bottom 0.406: 59.69,43.18 60.96,44.45 ARD-MEGA.D14
  Bottom 0.508: 59.69,43.18 59.69,16.51 66.04,10.16 Y-STOP.1
Y-STEP
  Bottom 0.406: U2.7 24.13,41.91 24.13,36.83 26.67,34.29 ARD-MEGA.A6
Z-1A
  Bottom 0.813: MOTOR_Z.2 U3.12
Z-1B
  Bottom 0.813: MOTOR_Z.1 U3.11
Z-2A
  Bottom 0.813: MOTOR_Z.3 U3.13
Z-2B
  Bottom 0.813: MOTOR_Z.4 U3.14
Z-DIR
  Bottom 0.406: U3.8 21.59,73.66 22.86,74.93 38.1,74.93 41.91,71.12 ARD-MEGA.D48
Z-EN
  Bottom 0.406: U3.1 22.86,50.8 24.13,49.53 24.13,46.99 29.21,41.91 29.21,38.1 30.48,36.83 ARD-MEGA.A8
Z-MIN
  Bottom 0.406: ARD-MEGA.D18 71.12,48.26 71.12,45.72 59.69,45.72 58.42,44.45
  Bottom 0.508: 58.42,44.45 58.42,12.7 60.96,10.16 Z-STOP.1
Z-STEP
  Bottom 0.406: U3.7 24.13,68.58 24.13,72.39 25.4,73.66 36.83,73.66 39.37,71.12 39.37,68.58 36.83,66.04 ARD-MEGA.D46

### Text on the board
Bottom: MikroPrintr / MK2560EM-G | Rev. 1G